# Altium schematic sheet AVkings_mazesolvver-mz1__Sheet_1_2025-12-17.schdoc
size 272 x 201 mm
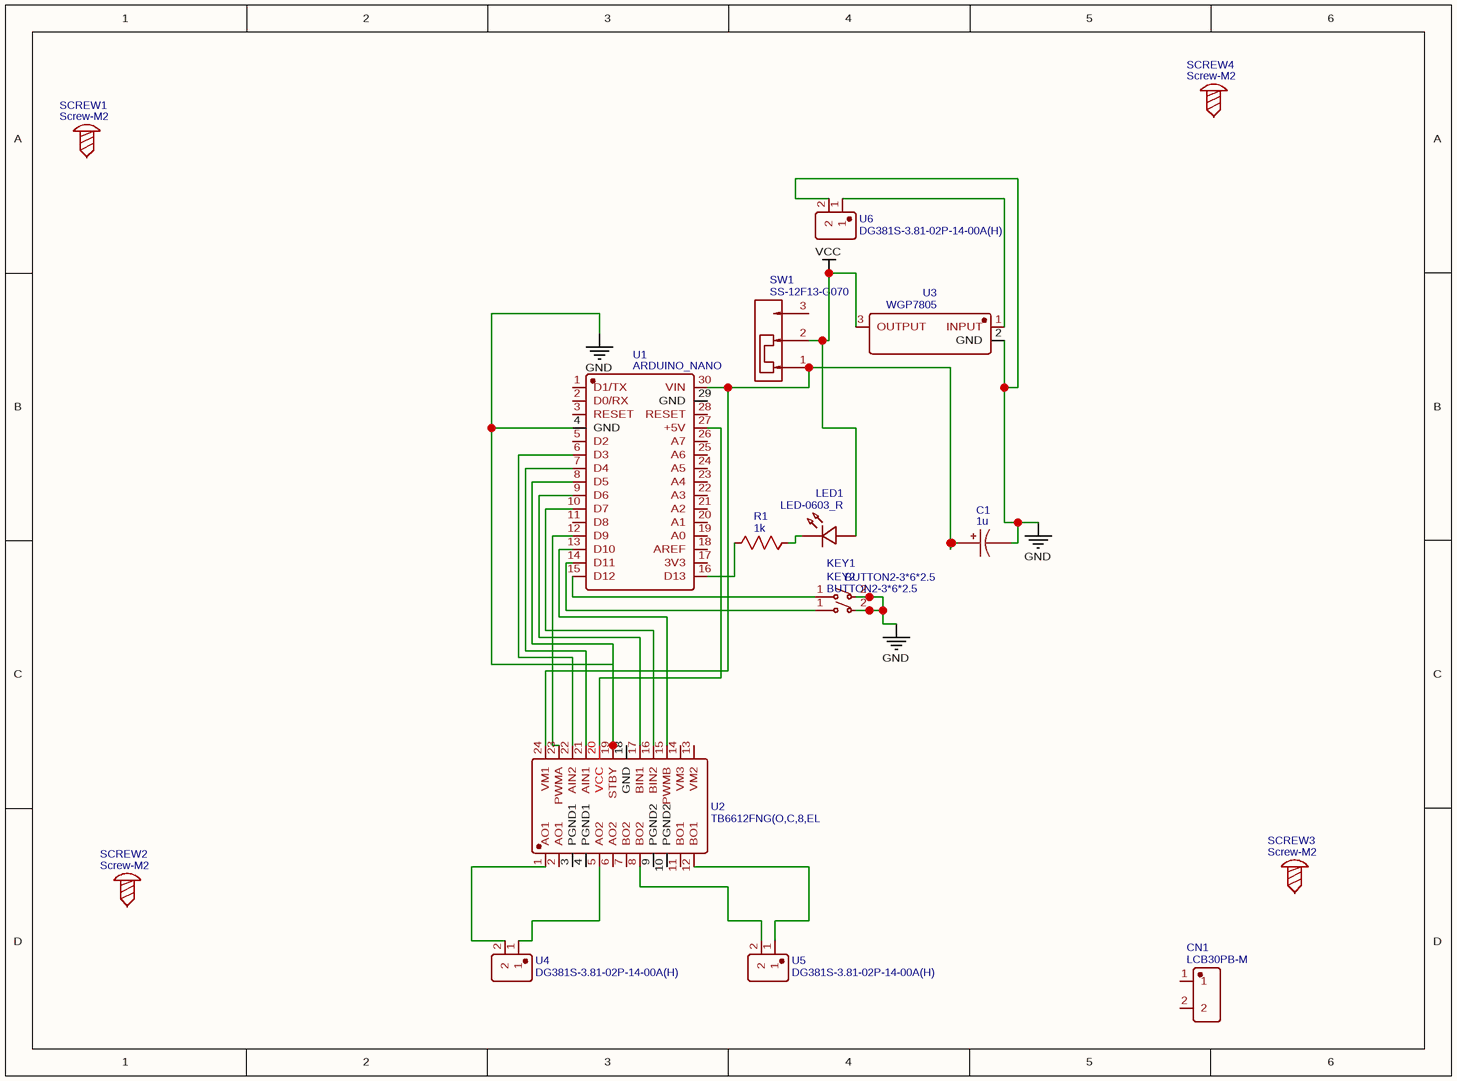
[diagram p0: AVkings_mazesolvver-mz1__Sheet_1_2025-12-17.schdoc]

## Parts
C1  1u  [CASE-A_3216]
CN1  LCB30PB-M  [CONN-TH_LCB30PB-M]
KEY1  BUTTON2-3*6*2.5  [SW-SMD_L6.0-W3.7-LS8.0]
KEY2  BUTTON2-3*6*2.5  [SW-SMD_L6.0-W3.7-LS8.0]
LED1  LED-0603_R  [LED0603_RED]
R1  1k  [R0603]
SCREW1  Screw-M2  [SCREW-M2]
SCREW2  Screw-M2  [SCREW-M2]
SCREW3  Screw-M2  [SCREW-M2]
SCREW4  Screw-M2  [SCREW-M2]
SW1  SS-12F13-G070  [SW-TH_SS-12F13-G070]
U1  ARDUINO_NANO  [COMM-TH_ARDUINO_NANO]
U2  TB6612FNG(O,C,8,EL  [SSOP-24_L8.4-W5.8-P0.65-LS7.8-BL]
U3  WGP7805  [TO-220-3_L9.9-W4.5-P2.54-L]
U4  DG381S-3.81-02P-14-00A(H)  [CONN-TH_DG381S-3.81-02P-14-00A]
U5  DG381S-3.81-02P-14-00A(H)  [CONN-TH_DG381S-3.81-02P-14-00A]
U6  DG381S-3.81-02P-14-00A(H)  [CONN-TH_DG381S-3.81-02P-14-00A]

## Nets
GND: C1.2 KEY1.2 KEY2.2 U1.4(GND) U1.8(D5) U2.19(STBY) U3.2(GND) U6.2
VCC: LED1.1 SW1.2 U3.3(OUTPUT)
NetC1_1: C1.1 SW1.1 U1.30(VIN) U2.24(VM1)
NetKEY1_1: KEY1.1 U1.15(D12)
NetKEY2_1: KEY2.1 U1.14(D11)
NetLED1_2: LED1.2 R1.2
NetR1_1: R1.1 U1.16(D13)
NetU1_6: U1.6(D3) U2.22(AIN2)
NetU1_7: U1.7(D4) U2.21(AIN1)
NetU1_9: U1.9(D6) U2.17(BIN1)
NetU1_10: U1.10(D7) U2.16(BIN2)
NetU1_12: U1.12(D9) U2.23(PWMA)
NetU1_13: U1.13(D10) U2.15(PWMB)
NetU1_27: U1.27(+5V) U2.20(VCC)
NetU2_1: U2.1(AO1) U4.2
NetU2_5: U2.5(AO2) U4.1
NetU2_8: U2.8(BO2) U5.2
NetU2_12: U2.12(BO1) U5.1
NetU3_1: U3.1(INPUT) U6.1

Not connected (* = marked no-connect by the designer): CN1 1 2; SCREW1 1; SCREW2 1; SCREW3 1; SCREW4 1; SW1 3; U1 1(D1/TX) 2(D0/RX) 3(RESET) 5(D2) 11(D8) 17(3V3) 18(AREF) 19(A0) 20(A1) 21(A2) 22(A3) 23(A4) 24(A5) 25(A6) 26(A7) 28(RESET) 29(GND); U2 2(AO1) 3(PGND1) 4(PGND1) 6(AO2) 7(BO2) 9(PGND2) 10(PGND2) 11(BO1) 13(VM2) 14(VM3) 18(GND)

## Library data of the parts
C1 = 1u: nameAlias: Value(F); Contributor: LCEDA_Lib; spicePre: C; spiceSymbolName: C_Tan_SMD_A_US
CN1 = LCB30PB-M: Manufacturer: AMASS(艾迈斯); Contributor: lcsc; Supplier: LCSC; Supplier Part: C5340347; Manufacturer Part: LCB30PB-M; JLCPCB Part Class: Extended Part; spicePre: C; spiceSymbolName: LCB30PB-M
KEY1 KEY2 = BUTTON2-3*6*2.5: Manufacturer: null; Contributor: LCSC; Supplier: LCSC; Supplier Part: C9900009018; Manufacturer Part: BUTTON2-3*6*2.5; JLCPCB Part Class: Extended Part; spicePre: K; spiceSymbolName: BUTTON2-3*6*2.5
LED1 = LED-0603_R: Manufacturer: EVERLIGHT(台湾亿光); Manufacturer Part: 19-217/R6C-AL1M2VY/3T; Contributor: LCEDA_01; Supplier Part: C72044; Supplier: LCSC; spicePre: L; spiceSymbolName: LED-0603_R
R1 = 1k: nameAlias: Value(Ω); Contributor: LCEDA_Lib; spicePre: R; spiceSymbolName: R_0603_US
SCREW1-SCREW4 = Screw-M2: Contributor: EasyEDA; spicePre: S; spiceSymbolName: Screw-M2
SW1 = SS-12F13-G070: Manufacturer: G-Switch(品赞); Contributor: LCSC; Supplier: LCSC; Supplier Part: C2848930; Manufacturer Part: SS-12F13-G070; JLCPCB Part Class: Extended Part; spicePre: S; spiceSymbolName: SS-12F13-G070
U1 = ARDUINO_NANO: Manufacturer: null; Contributor: lcsc; Supplier: LCSC; Supplier Part: C9900017879; Manufacturer Part: ARDUINO_NANO; JLCPCB Part Class: Extended Part; spicePre: U; spiceSymbolName: ARDUINO_NANO
U2 = TB6612FNG(O,C,8,EL: Manufacturer: TOSHIBA(东芝); Supplier: LCSC; Manufacturer Part: TB6612FNG(O,C,8,EL; Supplier Part: C88224; JLCPCB Part Class: Extended Part; spicePre: U; spiceSymbolName: TB6612FNG(O,C,8,EL
U3 = WGP7805: Manufacturer: Wild Goose(威谷); Contributor: lcsc; Supplier: LCSC; Supplier Part: C17702387; Manufacturer Part: WGP7805; spicePre: U; spiceSymbolName: WGP7805
U4-U6 = DG381S-3.81-02P-14-00A(H): Manufacturer: DEGSON(高正/高松); Contributor: LCSC; Supplier: LCSC; Supplier Part: C723984; Manufacturer Part: DG381S-3.81-02P-14-00A(H); JLCPCB Part Class: Extended Part; spicePre: U; spiceSymbolName: DG381S-3.81-02P-14-00A(H)